# Altium schematic sheet Overview.SchDoc
size A4
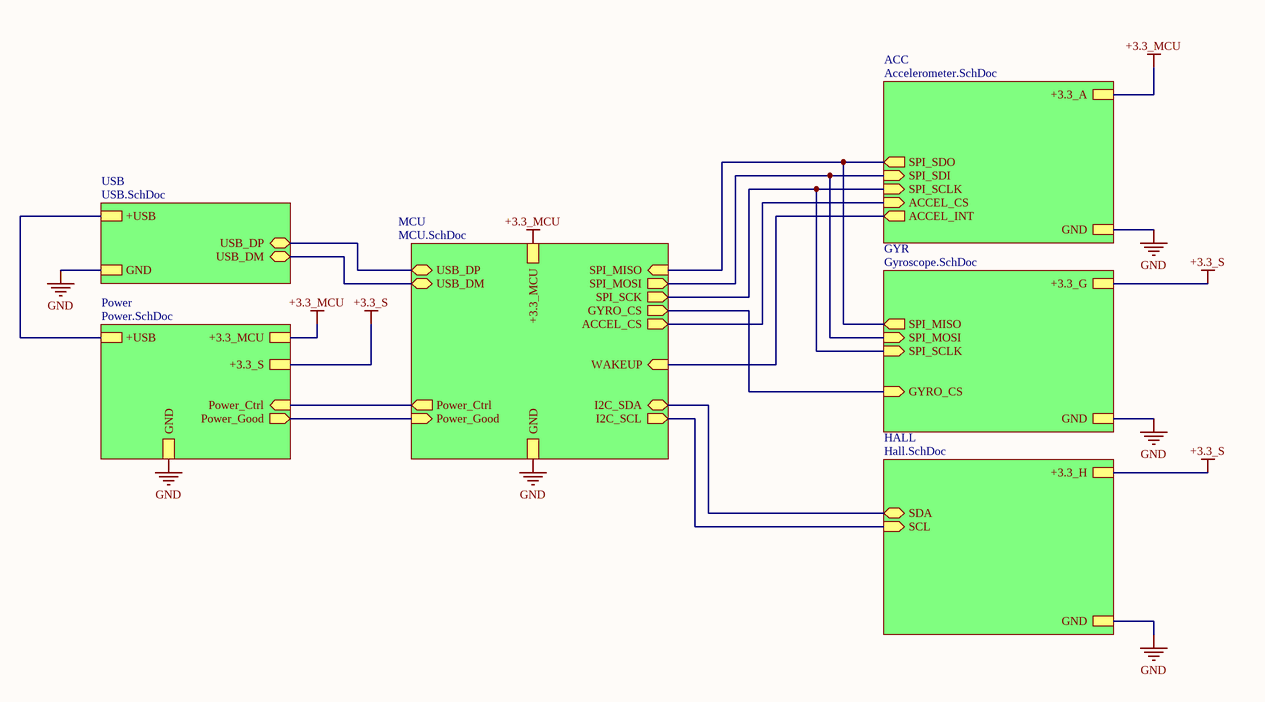
[diagram p0: Overview.SchDoc]

## Sub-sheets
ACC = Accelerometer.SchDoc: +3.3_A, SPI_SDO (out), GND, SPI_SCLK (in), ACCEL_INT (out), ACCEL_CS (in), SPI_SDI (in)
GYR = Gyroscope.SchDoc: SPI_MOSI (in), +3.3_G, SPI_SCLK (in), SPI_MISO (out), GYRO_CS (in), GND
HALL = Hall.SchDoc: +3.3_H, SCL (in), GND, SDA (bidir)
MCU = MCU.SchDoc: USB_DM (bidir), Power_Ctrl (out), GYRO_CS (out), GND, Power_Good (in), SPI_MISO (in), USB_DP (bidir), SPI_MOSI (out), +3.3_MCU, SPI_SCK (out), I2C_SCL (out), ACCEL_CS (out), I2C_SDA (bidir), WAKEUP (in)
Power = Power.SchDoc: +3.3_MCU, Power_Good (out), GND, +3.3_S, Power_Ctrl (in), +USB
USB = USB.SchDoc: GND, +USB, USB_DM (bidir), USB_DP (bidir)

## Nets
+3.3_MCU: sheet MCU/+3.3_MCU, sheet Power/+3.3_MCU, sheet ACC/+3.3_A
+3.3_S: sheet Power/+3.3_S, sheet HALL/+3.3_H, sheet GYR/+3.3_G
GND: sheet MCU/GND, sheet Power/GND, sheet HALL/GND, sheet GYR/GND, sheet ACC/GND, sheet USB/GND
(unnamed): sheet MCU/USB_DM, sheet USB/USB_DM
(unnamed): sheet MCU/Power_Ctrl, sheet Power/Power_Ctrl
(unnamed): sheet MCU/GYRO_CS, sheet GYR/GYRO_CS
(unnamed): sheet MCU/Power_Good, sheet Power/Power_Good
(unnamed): sheet MCU/SPI_MISO, sheet GYR/SPI_MISO, sheet ACC/SPI_SDO
(unnamed): sheet MCU/USB_DP, sheet USB/USB_DP
(unnamed): sheet MCU/SPI_MOSI, sheet GYR/SPI_MOSI, sheet ACC/SPI_SDI
(unnamed): sheet MCU/SPI_SCK, sheet GYR/SPI_SCLK, sheet ACC/SPI_SCLK
(unnamed): sheet MCU/I2C_SCL, sheet HALL/SCL
(unnamed): sheet MCU/ACCEL_CS, sheet ACC/ACCEL_CS
(unnamed): sheet MCU/I2C_SDA, sheet HALL/SDA
(unnamed): sheet MCU/WAKEUP, sheet ACC/ACCEL_INT
(unnamed): sheet Power/+USB, sheet USB/+USB